# EAGLE design Qduino_Mini (EAGLE 7.4.0)
DESIGNER: Quin from Qtechknow; VERSION: v14
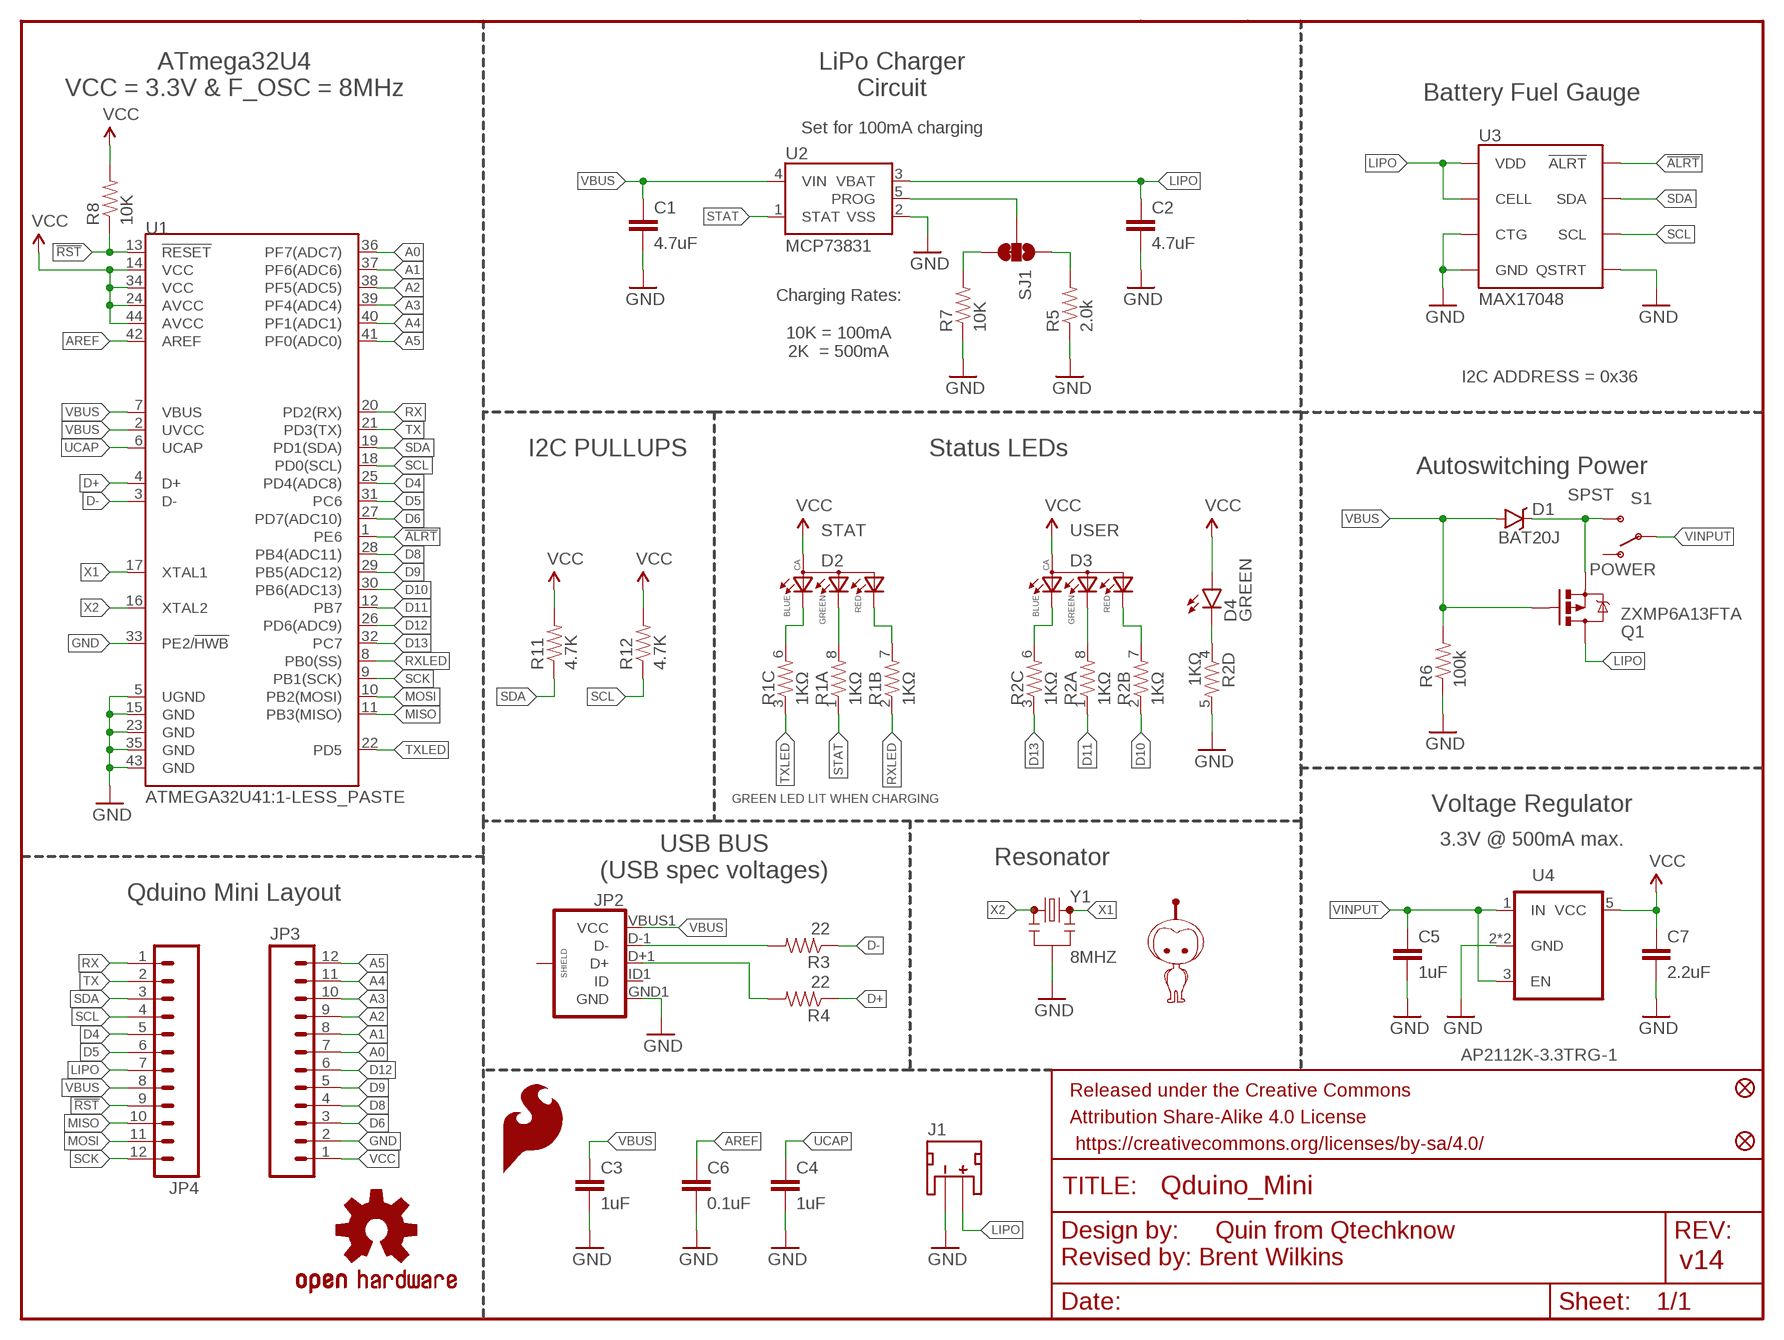
[diagram p0: schematic, sheet 1]

## Parts
C1  4.7uF  CAP0603-CAP  [0603-CAP]
C2  4.7uF  CAP0603-CAP  [0603-CAP]
C3  1uF  CAP0603-CAP  [0603-CAP]
C4  1uF  CAP0603-CAP  [0603-CAP]
C5  1uF  CAP0603-CAP  [0603-CAP]
C6  0.1uF  0.1UF-25V(+80/-20%)(0603)  [0603-CAP]
C7  2.2uF  2.2UF-10V-20%(0603)  [0603-CAP]
D1  BAT20J  DIODE-SCHOTTKY-BAT20J  [SOD-323]
D2  0.13_RGB_LEDPLCC  [P-LCC-4-3]
D3  0.13_RGB_LEDPLCC  [P-LCC-4-3]
D4  GREEN  LED-GREEN0603  [LED-0603]
FID1  FIDUCIALUFIDUCIAL  [MICRO-FIDUCIAL]
FID2  FIDUCIALUFIDUCIAL  [MICRO-FIDUCIAL]
FRAME2  FRAME-LETTER  [CREATIVE_COMMONS]
J1  LiPo  JST_2MM_MALE  [JST-2-SMD]
JP2  USB_MICROB_PLUGCONN-11752  [USB-B-MICRO-SMD_V03]
JP3  M12PTH  [1X12]
JP4  M12PTH  [1X12]
LOGO1  OSHW-LOGOS  [OSHW-LOGO-S]
LOGO2  SFE_LOGO_FLAME.1_INCH  [SFE_LOGO_FLAME_.1]
Q1  ZXMP6A13FTA  MOSFET-PCHANNEL  [SOT23-3]
R1  1KΩ  RESISTOR-ARRAY0603-ARV  [0603-ARV]
R2  1KΩ  RESISTOR-ARRAY0603-ARV  [0603-ARV]
R3  22  RESISTOR0603  [0603-RES]
R4  22  RESISTOR0603  [0603-RES]
R5  2.0k  2.0KOHM1/10W5%(0603)  [0603-RES]
R6  100k  100KOHM-1/10W-1%(0603)  [0603-RES]
R7  10K  10KOHM-1/10W-1%(0603)0603  [0603-RES]
R8  10K  10KOHM-1/10W-1%(0603)0603  [0603-RES]
R11  4.7K  RESISTOR0603-RES  [0603-RES]
R12  4.7K  RESISTOR0603-RES  [0603-RES]
S1  POWER  SWITCH-SPDT-SMD-A  [SWITCH-SPST-SMD-A]
SJ1  JUMPER-PAD-3-2OF3_NC_BY_TRACE_SMALL  [PAD-JUMPER-3-2OF3_NC_BY_TRACE_YES_SILK_FULL_BOX]
U1  ATMEGA32U41:1-LESS_PASTE  [QFN-44-NOPAD_1:1-LESS_PASTE]
U2  MCP73831  [SOT23-5]
U3  MAX17048  MAX17048DFN8  [DFN-8]
U4  AP2112K-3.3TRG-1  LDO-TPS78233  [SOT23-5]
U5  MIGHTYQ-L-SILK  [LOGO-LARGE-SILK]
Y1  8MHZ  RESONATOR8MHZ  [RESONATOR-SMD]

## Nets
!ALRT: U1.1(PE6) U3.P$5(!ALRT)
!RST: JP4.9 R8.1 U1.13(!RESET)
A0: JP3.7 U1.36(PF7(ADC7))
A1: JP3.8 U1.37(PF6(ADC6))
A2: JP3.9 U1.38(PF5(ADC5))
A3: JP3.10 U1.39(PF4(ADC4))
A4: JP3.11 U1.40(PF1(ADC1))
A5: JP3.12 U1.41(PF0(ADC0))
AREF: C6.1 U1.42(AREF)
D4: JP4.5 U1.25(PD4(ADC8))
D5: JP4.6 U1.31(PC6)
D6: JP3.3 U1.27(PD7(ADC10))
D8: JP3.4 U1.28(PB4(ADC11))
D9: JP3.5 U1.29(PB5(ADC12))
D10: R2.2 U1.30(PB6(ADC13))
D11: R2.1 U1.12(PB7)
D12: JP3.6 U1.26(PD6(ADC9))
D13: R2.3 U1.32(PC7)
D+: R4.1 U1.4(D+)
D-: R3.1 U1.3(D-)
GND: C1.2 C2.2 C3.2 C4.2 C5.2 C6.2 C7.2 J1.1(-) JP2.GND1(GND) JP3.2 R2.5 R5.1 R6.1 R7.1 U1.5(UGND) U1.15(GND) U1.23(GND) U1.33(PE2/!HWB) U1.35(GND) U1.43(GND) U2.2(VSS) U3.P$1(CTG) U3.P$4(GND) U3.P$6(QSTRT) U3.P$9(GND) U4.2(GND) U4.4(GND) Y1.2
INMOSFET: D1.C Q1.2(S) S1.3(S)
LIPO: C2.1 J1.2(+) JP4.7 Q1.3(D) U2.3(VBAT) U3.P$2(CELL) U3.P$3(VDD)
MISO: JP4.10 U1.11(PB3(MISO))
MOSI: JP4.11 U1.10(PB2(MOSI))
N$1: D2.3(BLUE) R1.6
N$2: D2.2(GREEN) R1.8
N$3: D3.3(BLUE) R2.6
N$4: D4.C R2.4
N$6: R7.2 SJ1.3
N$7: R5.2 SJ1.1
N$8: D3.2(GREEN) R2.8
N$34: D2.1(RED) R1.7
N$37: D3.1(RED) R2.7
PROG: SJ1.2 U2.5(PROG)
RX: JP4.1 U1.20(PD2(RX))
RXLED: R1.2 U1.8(PB0(SS))
SCK: JP4.12 U1.9(PB1(SCK))
SCL: JP4.4 R12.1 U1.18(PD0(SCL)) U3.P$7(SCL)
SDA: JP4.3 R11.1 U1.19(PD1(SDA)) U3.P$8(SDA)
STAT: R1.1 U2.1(STAT)
TX: JP4.2 U1.21(PD3(TX))
TXLED: R1.3 U1.22(PD5)
UCAP: C4.1 U1.6(UCAP)
UD+: JP2.D+1(D+) R4.2
UD-: JP2.D-1(D-) R3.2
VBUS: C1.1 C3.1 D1.A JP2.VBUS1(VCC) JP4.8 Q1.1(G) R6.2 U1.2(UVCC) U1.7(VBUS) U2.4(VIN)
VCC: C7.1 D2.4(ANODE) D3.4(ANODE) D4.A JP3.1 R8.2 R11.2 R12.2 U1.14(VCC) U1.24(AVCC) U1.34(VCC) U1.44(AVCC) U4.5(VCC)
VINPUT: C5.1 S1.2(P) U4.1(IN) U4.3(EN)
X1: U1.17(XTAL1) Y1.3
X2: U1.16(XTAL2) Y1.1
Unconnected: J1.NC1(PAD1) J1.NC2(PAD2) JP2.ID1(ID) JP2.SHIELD1(SHIELD) JP2.SHIELD2(SHIELD) JP2.SHIELD3(SHIELD) R1.4 R1.5 S1.1(O)

## Notes on the sheet
- ATmega32U4
  VCC = 3.3V & F_OSC = 8MHz
- LiPo Charger
  Circuit
- Battery Fuel Gauge
- Set for 100mA charging
- Charging Rates:
  
  10K = 100mA
  2K  = 500mA
- I2C ADDRESS = 0x36
- I2C PULLUPS | Status LEDs
- Autoswitching Power
- SPST
- STAT | USER
- GREEN LED LIT WHEN CHARGING | Voltage Regulator
- 3.3V @ 500mA max.
- USB BUS
  (USB spec voltages)
- Resonator
- Qduino Mini Layout
- Revised by: Brent Wilkins

## Library data of the parts
C1 C2 = SparkFun-Passives:CAP: Capacitor Standard 0603 ceramic capacitor, and 0.1" leaded capacitor.; PROD_ID: CAP-08280
C3-C5 = SparkFun-Passives:CAP: Capacitor Standard 0603 ceramic capacitor, and 0.1" leaded capacitor.; PROD_ID: CAP-00868
C6 = SparkFun-Capacitors:0.1UF-25V(+80/-20%)(0603): CAP-00810 Ceramic Standard decoupling cap; PROD_ID: CAP-00810
C7 = SparkFun-Capacitors:2.2UF-10V-20%(0603): CAP-07888; PROD_ID: CAP-07888
D1 = SparkFun-DiscreteSemi:DIODE-SCHOTTKY: Schottky diodes in SFE's production catalog BAT20J 1A 23V 0.62Vf RB751 120mA 40V 0.37Vf PMEG4005EJ 0.5A 40V 0.42Vf MBRA140 1A 40V 0.5Vf B340A 3A 40V SMA; PROD_ID: DIO-11623
D2 D3 = SparkFun-LED:0.13_RGB_LED: Everlight Red/Green/Blue LED 67-23/R6GHBHC-B01/2T || 67-23/R6GHBH-B01 Size 3.2*2.8*1.9mm Mounting Type SMD Full-Color LED PLCC4 Emitting Color Red/Green/Blue (620-625/530-535/470-475 nm) Chip Material AlGaInP/InGaN/InGaN Luminous Intensity 57-112/225-450/36-72 mcd Viewing Angle 120 deg Lens Type-Color Water Clear Forward Voltage 2.0/3.5/3.5 V Forward Current 10 mA Maximum Forward Voltage 2.4/3.9/3.9 V Maximum Forward Current 25/25/25 mA Min-Max Operating Temperature -40C to +85C Factory Pack 2000 pcs-Reel RoHS ✓; PROD_ID: DIO-12986
D4 = SparkFun-LED:LED-GREEN: Various green LEDs Green LEDs used in SFE Production 0603- DIO-00821 LARGE- DIO-00862 LILYPAD- DIO-09910; PROD_ID: DIO-00821
FID1 FID2 = SparkFun-Aesthetics:FIDUCIAL: Fiducial Alignment Points Various fiducial points for machine vision alignment.
FRAME2 = SparkFun-Aesthetics:FRAME-LETTER: Schematic Frame Standard 8.5x11 US Letter frame
J1 = SparkFun-Connectors:JST_2MM_MALE: Mates to single-cell LiPo batteries. CONN-11443 Now with smashable polarity marks!; BTM_NEG: -; BTM_POS: +; PROD_ID: CONN-11443; TOP_NEG: -; TOP_POS: +
JP2 = SparkFun-Connectors:USB_MICROB_PLUG: USB Micro-B connectors Some male, some female. Watch your step!; PROD_ID: CONN-11752
JP3 JP4 = SparkFun-Connectors:M12: Header 12 Standard 12-pin 0.1" header. Use with straight break away headers (SKU : PRT-00116), right angle break away headers (PRT-00553), swiss pins (PRT-00743), machine pins (PRT-00117), and female headers (PRT-00115).; PROD_ID: CONN-09693
LOGO1 = SparkFun-Aesthetics:OSHW-LOGO: Open Source Hardware Logo This logo indicates the piece of hardware it is found on incorporates a OSHW license and/or adheres to the definition of open source hardware found here: http://freedomdefined.org/OSHW
LOGO2 = SparkFun-Aesthetics:SFE_LOGO_FLAME: SFE Logo, flame only This is the SparkFun flame logo. The logo on the schematic will always be the same size; the package variant is the height of the flame. Default layer for the logo on the board is tSilk.
Q1 = SparkFun-DiscreteSemi:MOSFET-PCHANNEL: Generic PMOSFET IRLML2244 - TRANS-11153 (SOT-23 -20V -4.3A) (1.Gate 2.Source 3.Drain) FQP27P06 - COM-10349 <http://www.sparkfun.com/products/10349> (TO-220 -60V -27A) (1.Gate 2.Source 3.Drain); PROD_ID: TRANS-08285
R1 R2 = SparkFun-Passives:RESISTOR-ARRAY: Array Chip Resistor Source: RS Component / Phycomp; PROD_ID: RES-12985
R3 R4 = SparkFun-Resistors:RESISTOR: Resistor Basic schematic elements and footprints for 0603, 1206, and PTH resistors.; PROD_ID: RES-08698
R5 = SparkFun-Resistors:2.0KOHM1/10W5%(0603): RES-08296; PROD_ID: RES-08296
R6 = SparkFun-Resistors:100KOHM-1/10W-1%(0603): RES-07828; PROD_ID: RES-07828
R7 R8 = SparkFun-Resistors:10KOHM-1/10W-1%(0603): RES-00824; PROD_ID: RES-00824
R11 R12 = SparkFun-Passives:RESISTOR: Resistor Basic schematic elements and footprints for 0603, 1206, and PTH resistors.; PROD_ID: RES-07857
S1 = SparkFun-Electromechanical:SWITCH-SPDT: SPDT Switch Simple slide switch, Spark Fun Electronics SKU : COM-00102 DPDT SMT slide switch, AYZ0202, SWCH-08179; PROD_ID: SWCH-10651
SJ1 = SparkFun-Passives:JUMPER-PAD-3-2OF3_NC_BY_TRACE
U1 = SparkFun-DigitalIC:ATMEGA32U4: Atmel 44-pin 8-bit Microcontroller with 32KBytes of ISP Flash and USB Controller; PROD_ID: IC-10828
U2 = SparkFun:MCP73831: Microchip's MCP73831 Miniature single cell, fully integrated Li-Ion, Li-polymer charge management controller http://ww1.microchip.com/downloads/en/DeviceDoc/21984a.pdf; PROD_ID: IC-09995
U3 = SparkFun-DigitalIC:MAX17048: Micropower 1-Cell Li+ ModelGauge; PROD_ID: IC-12551
U4 = SparkFun-PowerIC:LDO-TPS78233: Voltage Regulator LDO 500nA Ground Current, 150mA, Ultra-Low Quiescent Current Low-Dropout Linear Regulator.; PROD_ID: VREG-12457
U5 = SparkFun-Aesthetics:MIGHTYQ-L-SILK
Y1 = SparkFun-FreqCtrl:RESONATOR: Resonator Small SMD resonator. Used, eg, on the Arduino Pro/ Pro Mini boards. 8MHz- XTAL-08895 16MHz- XTAL-08900; PROD_ID: XTAL-08895

## Net classes
2 gnd: width 0.254 mm, drill 0.61 mm, clearance 0.254 mm

## Board
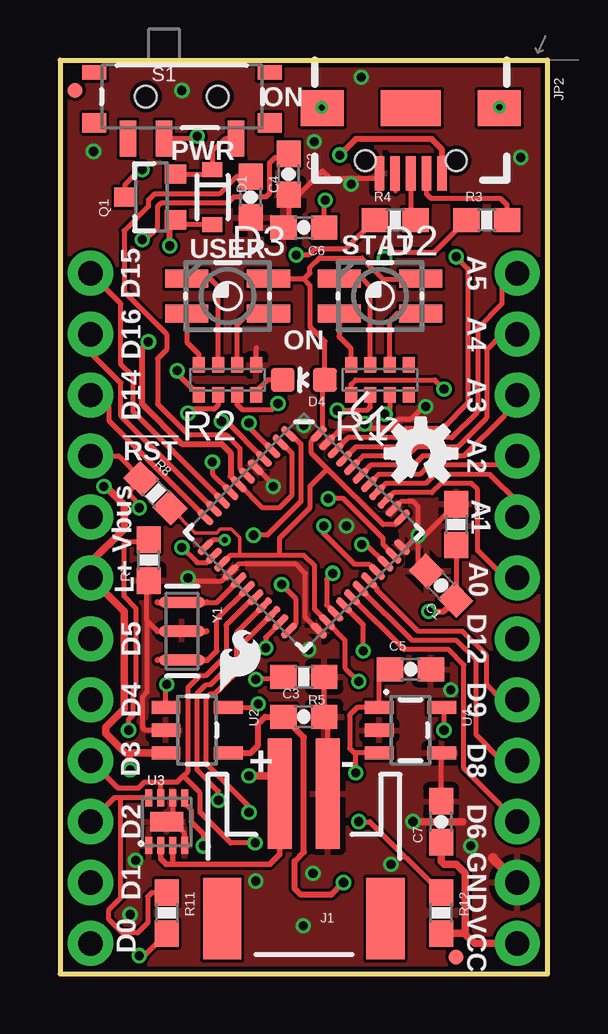
[diagram p1: board, top side]
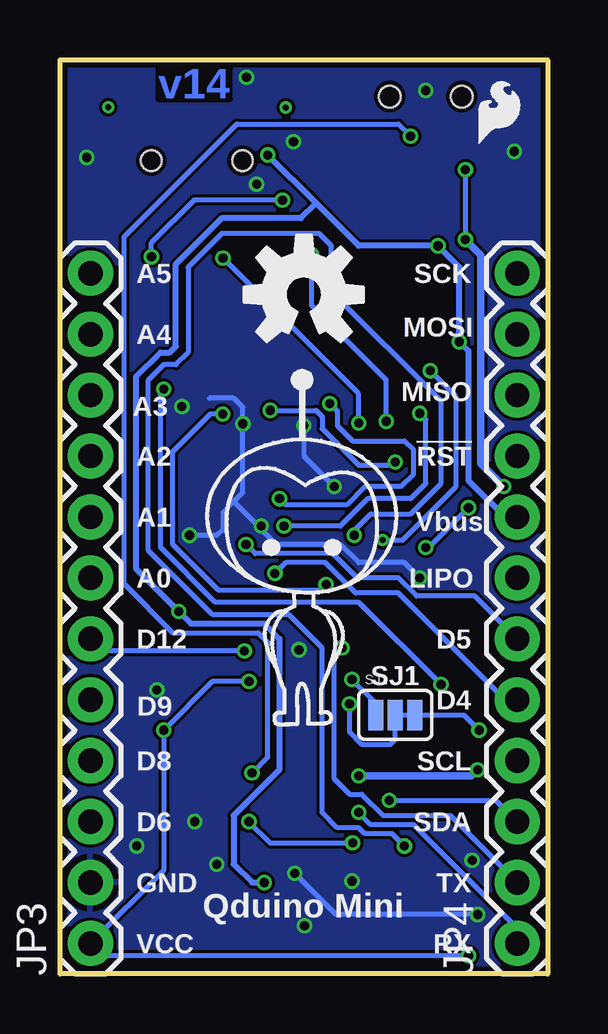
[diagram p2: board, bottom side, seen from below]

Size 20.32 x 38.1 mm. Coordinates in mm from the lower left corner, seen from the top.
Outline: 0,38.1 0,0 20.32,0 20.32,38.1 0,38.1
Copper layers (1*16): Top 0.035mm / dielectric 1.5mm / Bottom 0.035mm
Design rules "Gold_Phoenix_Standard_Spec_2_layer": minimum track width 5mil, minimum drill 6mil, track to track 5mil, track to pad 5mil, pad to pad 5mil, via to via 5mil, smd to smd 5mil, copper to edge 8mil, drill to drill 8mil, minimum pad ring 5mil, minimum via ring 5mil, stop-mask expansion 4mil, vias tented up to drill 20mil, thermal gap 10mil
tRestrict: area 4.3,13.4 to 5.9,13.8; area 4.3,14.7 to 4.4,15.2; area 4.4,16 to 5.9,16

### Footprints (pad centres in the part's own frame; a part is rotated, then mirrored left to right if it is on the bottom)
0603-CAP = smd 1.1 x 1: 1 -0.85,0; 2 0.85,0
SOD-323 = smd 0.63 x 0.83: A 1.15,0; C -1.15,0
P-LCC-4-3 = smd 0.75 x 1.8: 1 0.725,1.7; 2 -0.725,1.7; 3 -0.725,-1.7; 4 0.725,-1.7
LED-0603 = smd 1 x 1: A 0,-0.877; C 0,0.877
MICRO-FIDUCIAL = smd 0.635 x 0.635: 1 0,0
JST-2-SMD = smd 1 x 4.6: 1 -1,-3.7; 2 1,-3.7 | smd 1.6 x 3.4: NC1 -3.4,1.5; NC2 3.4,1.5
USB-B-MICRO-SMD_V03 = smd 1.45 x 0.4: D+1 2.725,0; D-1 2.725,0.65; GND1 2.725,-1.3; ID1 2.725,-0.65; VBUS1 2.725,1.3 | smd 1.5 x 1.8: SHIELD1 0,3.685; SHIELD2 0,-3.685 | smd 1.5 x 2.5: SHIELD3 0,0 | hole 0.85: 2.2,1.9; 2.2,-1.9
1X12 = drill 1.016 pad 1.88: 1 0,0; 2 2.54,0; 3 5.08,0; 4 7.62,0; 5 10.16,0; 6 12.7,0; 7 15.24,0; 8 17.78,0; 9 20.32,0; 10 22.86,0; 11 25.4,0; 12 27.94,0
SOT23-3 = smd 0.8 x 0.9: 1 -0.95,-1; 2 0.95,-1; 3 0,1.1
0603-ARV = smd 0.5 x 0.65: 1 -1.2,-0.625; 2 -0.4,-0.625; 3 0.4,-0.625; 4 1.2,-0.625; 5 1.2,0.625; 6 0.4,0.625; 7 -0.4,0.625; 8 -1.2,0.625
0603-RES = smd 1.1 x 1: 1 -0.85,0; 2 0.85,0
SWITCH-SPST-SMD-A = smd 0.7 x 1.5: 1 -2.25,-1.75; 2 -0.75,-1.75; 3 2.25,-1.75 | smd 1 x 0.6: GND1 -3.65,1; GND3 3.65,1 | smd 1 x 0.8: GND2 -3.65,-1.1; GND4 3.65,-1.1 | hole 0.9: -1.5,0; 1.5,0
PAD-JUMPER-3-2OF3_NC_BY_TRACE_YES_SILK_FULL_BOX = smd 0.635 x 1.27: 1 -0.813,0; 2 0,0; 3 0.813,0
QFN-44-NOPAD_1:1-LESS_PASTE = smd 0.8 x 0.3: 1 -3.337,2.458; 2 -3.337,1.958; 3 -3.337,1.479; 4 -3.337,0.979; 5 -3.337,0.5; 6 -3.337,0; 7 -3.337,-0.5; 8 -3.337,-0.979; 9 -3.337,-1.479; 10 -3.337,-1.958; 11 -3.337,-2.458; 23 3.337,-2.458; 24 3.337,-1.958; 25 3.337,-1.479; 26 3.337,-0.979; 27 3.337,-0.5; 28 3.337,0; 29 3.337,0.5; 30 3.337,0.979; 31 3.337,1.479; 32 3.337,1.958; 33 3.337,2.458 | smd 0.3 x 0.8: 12 -2.458,-3.337; 13 -1.958,-3.337; 14 -1.479,-3.337; 15 -0.979,-3.337; 16 -0.5,-3.337; 17 0,-3.337; 18 0.5,-3.337; 19 0.979,-3.337; 20 1.479,-3.337; 21 1.958,-3.337; 22 2.458,-3.337; 34 2.458,3.337; 35 1.958,3.337; 36 1.479,3.337; 37 0.979,3.337; 38 0.5,3.337; 39 0,3.337; 40 -0.5,3.337; 41 -0.979,3.337; 42 -1.479,3.337; 43 -1.958,3.337; 44 -2.458,3.337
SOT23-5 = smd 0.55 x 1.2: 1 -0.95,-1.3; 2 0,-1.3; 3 0.95,-1.3; 4 0.95,1.3; 5 -0.95,1.3
DFN-8 = smd 0.3 x 0.7: P$1 -0.75,-0.99; P$2 -0.25,-0.99; P$3 0.25,-0.99; P$4 0.75,-0.99; P$5 0.75,0.99; P$6 0.25,0.99; P$7 -0.25,0.99; P$8 -0.75,0.99 | smd 1.38 x 0.8: P$9 0,0
RESONATOR-SMD = smd 0.45 x 1.905: 1 -1.2,0; 2 0,0; 3 1.2,0

### Placement (x,y rotation side)
C1  15.88,16.19 135 top
C2  9.53,33.34 270 top
C3  10.16,10.72 0 top
C4  7.94,32.38 270 top
C5  14.61,12.7 0 top
C6  10.16,31.11 180 top
C7  15.88,6.35 90 top
D1  6.35,32.38 270 top
D2  13.34,28.26 90 top
D3  6.99,28.26 90 top
D4  10.16,24.77 90 top
FID1  0.64,36.83 0 top
FID2  16.51,0.71 0 top
FRAME2  -20.9,-8.66 0 top  (outside the outline)
J1  10.16,3.81 180 top
JP2  14.62,36.1 270 top
JP3  19.05,1.27 90 bottom
JP4  1.27,1.27 90 bottom
LOGO1  15.04,21.69 0 top
LOGO2  3.17,34.29 0 bottom
LOGO3  SFE_LOGO_FLAME.1_INCH  [SFE_LOGO_FLAME_.1@1]  6.35,11.43 0 top
Q1  3.81,32.38 90 top
R1  13.34,24.77 0 top
R2  6.99,24.77 0 top
R3  17.78,31.43 0 top
R4  13.97,31.43 0 top
R5  10.16,12.38 180 top
R6  16.51,18.73 270 top
R7  3.7,17.25 90 top
R8  3.99,20.04 315 top
R11  4.45,2.54 270 top
R12  15.88,2.54 270 top
S1  5.08,36.58 0 top
SJ1  6.35,10.79 0 bottom
U1  10.16,18.41 315 top
U2  5.71,10.16 270 top
U3  4.45,6.35 0 top
U4  14.61,10.16 270 top
U5  10.16,15.88 0 bottom
U$4  [OSHW-LOGO-M@1]  10.16,28.32 0 bottom
Y1  5.08,14.29 270 top

### Tracks (layer width: path | path; a pad name or v marks a point on that pad's centre or on a via)
!ALRT  (via drill 0.38)
  Top 0.203: U1.1 9.62,22.51 10.03,22.1 10.03,19.68 8.64,18.29 v8.06,18.29 | v5.97,5.33 5.97,5.84 5.46,6.35 5.46,6.83 5.2,7.1 U3.P$5
  Bottom 0.203: v8.06,18.29 8.06,18.48 7.37,19.18 5.71,19.18 4.45,20.45 4.45,23.88 9.02,28.45 9.02,30.35 9.53,30.86 13.59,30.86 14.99,29.46 14.99,25.91 15.49,25.4 16,25.4 16.64,24.77 16.64,17.65 13.97,14.99 10.79,14.99 9.4,13.59 9.4,6.73 8.76,6.1 7.87,6.1 7.62,5.84 6.48,5.84 v5.97,5.33
!RST  (via drill 0.38)
  Top 0.203: U1.13 6.12,17.14 5.71,17.14 v5.08,17.78 | JP4.9 2.44,21.59 R8.1 2.92,20.18 2.92,19.94 3.3,19.56 v3.3,19.43
  Bottom 0.203: v3.3,19.43 4.95,17.78 v5.08,17.78
A0
  Top 0.203: JP3.7 18.54,16.51 17.4,17.65 17.4,20.19 17.14,20.45 15.88,20.45 15.49,20.07 13.9,20.07 U1.36
A1
  Top 0.203: JP3.8 19.05,19.68 17.91,20.83 15.62,20.83 15.24,20.45 13.58,20.45 U1.37
A2
  Top 0.203: JP3.9 18.8,21.59 18.41,21.21 15.37,21.21 14.99,20.83 13.28,20.83 U1.38
A3
  Top 0.203: JP3.10 18.54,23.62 18.54,23.3 16.83,21.59 15.11,21.59 14.73,21.21 12.95,21.21 U1.39
A4
  Top 0.203: JP3.11 18.41,26.67 17.78,26.04 17.78,23.18 16.57,21.97 14.86,21.97 14.48,21.59 12.63,21.59 U1.40
A5
  Top 0.203: JP3.12 18.92,29.21 18.41,28.7 18.41,27.94 17.4,26.92 17.4,23.43 16.32,22.35 14.61,22.35 14.22,21.97 12.33,21.97 U1.41
AREF  (via drill 0.38)
  Top 0.203: C6.1 11.01,32.22 v11.05,32.26 | v16.51,29.9 17.02,29.39 17.02,23.81 15.94,22.73 14.35,22.73 13.97,22.35 12.01,22.35 U1.42
  Bottom 0.203: v16.51,29.9 16.51,30.48 14.73,32.26 v11.05,32.26
D4  (via drill 0.38)
  Top 0.203: v11.37,16.7 11.11,16.45 11.11,15.37 U1.25
  Bottom 0.203: JP4.5 1.78,11.43 6.22,15.88 8,15.88 9.27,17.14 10.92,17.14 v11.37,16.7
D5  (via drill 0.38)
  Top 0.203: U1.31 12.76,17.91 v12.57,17.91
  Bottom 0.203: JP4.6 3.05,15.75 5.46,15.75 6.22,16.51 7.94,16.51 8.95,17.53 12.19,17.53 v12.57,17.91
D6
  Top 0.203: JP3.3 16.83,8.57 16.83,12.89 16.19,13.53 14.34,13.53 U1.27
D8
  Top 0.203: JP3.4 18.41,8.89 17.34,9.97 17.34,13.08 16.51,13.91 14.67,13.91 U1.28
D9
  Top 0.203: JP3.5 18.41,11.43 17.78,12.06 17.78,13.27 16.76,14.29 14.92,14.29 13.21,16 13.21,16.07 U1.29
D10  (via drill 0.38)
  Top 0.203: v10.99,18.67 10.99,18.35 12.26,17.08 12.88,17.08 U1.30 | R2.2 6.58,23.7 6.43,23.55 5.51,23.55 v5.33,23.37
  Bottom 0.203: v5.33,23.37 5.08,23.11 5.08,20.45 5.71,19.81 7.49,19.81 8.64,18.67 v10.99,18.67
D11  (via drill 0.25, 0.38)
  Top 0.203: v6.87,18.09 6.35,18.09 U1.12 | R2.1 4.89,25.04 v4.89,25.15
  Bottom 0.203: v6.87,18.09 6.04,18.09 3.81,20.32 3.81,24.07 v4.89,25.15
D12  (via drill 0.38)
  Top 0.203: v12.64,13.46 12.64,14.55 U1.26
  Bottom 0.203: v12.64,13.46 18.54,13.46 JP3.6
D13  (via drill 0.38)
  Top 0.203: U1.32 13.9,17.46 13.46,17.91 13.46,18.16 11.81,19.81 v11.18,19.81 | R2.3 7.38,23.73 7.59,23.52 8.83,23.52 v9.08,23.77
  Bottom 0.203: v11.18,19.81 10.92,19.56 8.38,19.56 7.62,20.32 6.1,20.32 5.59,20.83 5.59,21.84 5.97,22.23 8.13,22.23 8.76,22.86 8.76,23.46 v9.08,23.77
D+  (via drill 0.38)
  Top 0.203: v6.73,23.04 6.92,23.04 U1.4 | R4.1 11.91,30.23 10.62,30.23 10.36,29.97 v9.84,29.97
  Bottom 0.203: v6.73,23.04 6.73,24.77 9.84,27.88 v9.84,29.97
D-  (via drill 0.38)
  Top 0.203: v13.53,29.84 13.78,30.1 15.6,30.1 R3.1 | 8.51,22.16 U1.3 7.87,22.79 v7.87,22.96
  Bottom 0.203: v7.87,22.96 7.87,24.19 v13.53,29.84
GND  (via drill 0.38)
  Top 0.203: 15.55,9.21 U4.4 15.88,9.18 C7.2 15.56,7.51 | U1.15 | R2.5 8.19,26.09 | U1.15 7.1,16.75 | 6.87,16.51 U1.15 | 6.1,14.29 4.06,14.29 3.62,14.73 | 3.62,14.73 3.62,16.22 | v5.33,16.51 5.46,16.38 6.74,16.38 U1.15 | U1.33 14.43,17.79 v14.92,18.29 | C1.2 14.92,17.14 v14.92,18.29 | 14.99,23.5 14.61,23.11 14.1,23.11 13.72,22.73 11.71,22.73 U1.43 | U2.2 3.56,10.16 3.43,10.29 3.43,11.56 3.62,11.75 3.62,14.73 | C6.2 9.53,31.33 C2.2 9.95,32.49 10.93,33.47 11.26,33.15 13.34,33.15 13.31,33.17 JP2.GND1 | v8.89,20.32 8.89,20.39 U1.5 | C4.2 7.94,31.18 | R6.1 15.22,18.29 v14.92,18.29 | v14.92,18.29 14.92,19.49 14.73,19.68 14.2,19.68 U1.35 | U1.15 7.44,17.08 9.84,17.08 10.22,16.7 10.22,14.86 10.77,14.32 U1.23 11.01,14.09 | 4.44,6.35 U3.P$9 | 3.05,2.6 v2.92,2.48 | J1.1 11.16,10.57 C3.2 R5.1 | 16.78,6.3 16.78,6.35 | U3.P$4 5.2,5.85 4.98,6.07 4.72,6.07 4.72,6.08 U3.P$9 | U3.P$6 4.7,6.62 4.45,6.37 U3.P$9
  Top 0.305: 16.78,6.35 v14.71,6.35
  Top 0.406: JP3.2 18.03,4.83
  Bottom 0.203: 13.08,19.68 12.7,20.07 12.7,23.62 13.08,24 14.1,24 | 13.08,19.68 13.53,19.24 13.53,18.54 13.78,18.29 v14.92,18.29 | v10.16,22.86 10.16,21.59 v8.89,20.32 | v5.33,16.51 5.97,17.14 7.87,17.14 8.64,17.91 11.3,17.91 13.08,19.68 | v2.92,2.48 8.83,2.48 v10.54,4.19
  other vias: 15.24,23.65 10.13,2.01 5.08,36.83 19.2,34.04 10.36,13.51 1.4,34.29 17.12,5.33 13.79,4.57 16.28,11.84 12.7,22.94 3.15,4.74 8.15,3.87 11.94,18.67 12.13,32.92 10.59,34.7 12.55,37.38
  pour Bottom: 0,38.1 20.32,38.1 20.32,0 0,0
  pour Top: 0,38.1 20.32,38.1 20.32,0 0,0
INMOSFET
  Top 0.203: Q1.2 6.15,33.34 D1.C 6.35,34.29 6.89,34.83 S1.3
LIPO  (via drill 0.38)
  Top 0.203: 8.89,7.24 J1.2 9.16,8.26 | C2.1 9.37,34.04 8.95,34.04 8.73,33.81 8.73,32.54 8.57,32.38 7.24,32.38 6.99,32.13 4.19,32.13 4.06,32 4.06,31.11 3.56,30.61 v3.43,30.61 | Q1.3 2.71,32.91 3.33,33.53 v3.43,33.53 | 2.9,9.21 2.73,9.21
  Top 0.229: 4.67,4.57 4.42,4.57 4.2,4.8 U3.P$2 | 4.67,4.57 8.74,4.57 9.16,4.99 J1.2 | U3.P$3 4.7,4.59 4.67,4.57
  Top 0.305: 2.73,9.21 1.91,10.03 1.91,10.29 2.67,11.05 2.67,15.11 JP4.7 1.27,17.14 2.67,18.54 2.67,19.56 1.91,20.32 v1.83,20.32 | U2.3 2.9,9.21 2.9,8.53 v2.92,8.51 | v7.87,8.26 9.16,8.26
  Bottom 0.203: v3.43,33.53 v3.43,30.61
  Bottom 0.305: v3.43,30.61 2.79,29.97 2.79,21.29 v1.83,20.32 | v2.92,8.51 3.17,8.26 v7.87,8.26
MISO
  Top 0.203: JP4.10 1.52,24.13 2.03,23.62 2.03,23.07 U1.11
MOSI
  Top 0.203: U1.10 2.54,23.27 2.54,24.64 1.27,25.91 JP4.11
N$1
  Top 0.203: D2.3 14.04,27.53 13.73,27.22 R1.6
N$2
  Top 0.203: D2.2 11.63,26.58 12.13,26.08 R1.8
N$3
  Top 0.203: D3.3 7.85,27.53 7.38,27.07 R2.6
N$4
  Top 0.203: D4.C 8.66,24.77 8.19,24.29 R2.4
N$5
  Top 0.203: 13.97,32.89 13.97,32.64
N$6  (via drill 0.38)
  Top 0.203: v2.86,10.16 2.86,10.6 3.05,10.79 3.05,11.81 3.17,11.94 3.17,15.24 2.67,15.75 2.67,17.91 2.79,18.03 3.51,18.03 3.57,18.1 R7.2
  Bottom 0.203: SJ1.3 3.49,10.79 v2.86,10.16
N$7  (via drill 0.38)
  Top 0.203: v8.15,12.28 8.19,12.32 9.25,12.32 R5.2
  Bottom 0.203: v8.15,12.28 7.16,11.29 SJ1.1
N$8
  Top 0.203: D3.2 5.29,26.34 5.79,25.84 R2.8
N$9  (via drill 0.25)
  other vias: 18.31,36.13
N$10  (via drill 0.25)
  other vias: 10.91,36.12
N$34
  Top 0.203: R1.7 12.94,28.66 12.61,28.98 D2.1
N$37
  Top 0.203: R2.7 6.58,28.66 6.26,28.98 D3.1
PROG  (via drill 0.38)
  Top 0.203: U2.5 8.11,11.11 v8.26,11.25
  Bottom 0.203: v8.26,11.25 8.26,10.08 7.72,9.55 6.58,9.55 6.35,9.78 SJ1.2
RX  (via drill 0.38)
  Top 0.203: 8.79,15.01 U1.20 7.75,13.91 7.75,12.95 6.48,11.68 6.29,11.68 6.1,11.49 6.1,8.76 7.87,6.99 v7.87,6.73
  Bottom 0.203: JP4.1 1.27,1.91 5.59,6.22 7.37,6.22 v7.87,6.73
RXLED  (via drill 0.38)
  Top 0.203: v11.56,23.5 12.8,23.5 12.93,23.62 R1.2 | v6.35,21.34 6.35,20.84 U1.8
  Bottom 0.203: v11.56,23.5 9.65,23.5 9.4,23.24 9.4,22.73 7.87,21.21 6.48,21.21 v6.35,21.34
SCK
  Top 0.203: U1.9 3.05,23.44 3.05,24.89 2.54,25.4 2.54,27.94 JP4.12
SCL  (via drill 0.38)
  Top 0.203: U1.18 8.08,15.7 6.92,14.54 6.92,13.27 6.1,12.45 5.84,12.45 5.33,11.94 5.33,8.45 5.14,8.25 | 4.17,8 3.53,8 3.28,7.75 2.41,7.75 JP4.4 | 4.17,8 4.89,8 5.14,8.25 | v8.13,5.46 7.11,5.46 5.84,6.73 5.84,7.54 5.14,8.25 | v12.45,6.35 12.91,6.35 R12.1 | U3.P$7 4.2,7.97 4.17,8
  Bottom 0.203: v12.45,6.35 11.56,5.46 v8.13,5.46
SDA  (via drill 0.38)
  Top 0.203: 2.25,7.33 JP4.3 | U1.19 7.37,14.24 7.37,13.14 6.29,12.06 6.1,12.06 5.71,11.68 5.71,8.51 6.6,7.62 v6.6,7.24 | R11.1 3.82,3.39 3.65,3.22 3.65,2.13 3.24,1.71 2.6,1.71 2.03,2.29 2.03,2.67 2.54,3.17 2.54,7.33 2.25,7.33 | U3.P$8 2.26,7.34 2.25,7.33
  Bottom 0.203: v6.6,7.24 2.16,7.24 JP4.3
STAT  (via drill 0.38)
  Top 0.203: R1.1 12.13,24.58 12.32,24.77 15.62,24.77 v16,24.38 | U2.1 4.42,12.04 v4.45,12.06
  Bottom 0.203: v4.45,12.06 7.87,15.49 13.84,15.49 16.13,17.78 16.13,24.26 v16,24.38
TX  (via drill 0.38)
  Top 0.203: U1.21 9.19,14.65 8.57,14.03 v8.57,13.59
  Bottom 0.203: JP4.2 4.06,6.6 6.86,6.6 7.75,7.49 8.26,7.49 8.89,8.13 8.89,13.27 v8.57,13.59
TXLED  (via drill 0.38)
  Top 0.203: U1.22 9.84,14.62 9.84,15.62 v9.23,16.23 | R1.3 13.73,23.54 v13.54,23.34
  Bottom 0.203: v9.23,16.23 9.46,16 13.72,16 15.62,17.91 15.62,21.78 14.06,23.34 v13.54,23.34
UCAP
  Top 0.203: C4.1 7.35,33.23 6.63,32.51 3.94,32.51 3.68,32.26 3.68,32 2.67,30.99 2.67,28.45 4.45,26.67 4.45,26.04 4.06,25.65 4.06,23.75 5.33,22.48 6.92,22.48 7.49,21.91 7.49,21.08 U1.6
UD+
  Top 0.203: JP2.D+1 14.62,31.64 R4.2
UD-
  Top 0.203: R3.2 18.63,32.06 18.36,32.32 15.47,32.32 15.27,32.52 JP2.D-1
VBUS  (via drill 0.38)
  Top 0.203: JP2.VBUS1 15.91,33.23 | 6.47,31.11 D1.A 5.01,31.23 Q1.1 4.57,31.2 | U1.2 9.21,22.16 9.65,21.72 9.65,19.94 9.14,19.43 8.44,19.43 U1.7 | R6.2 16.51,15.62 C1.1
  Top 0.254: v15.37,15.11 16,15.11 C1.1 | U1.7 7.11,20.76 7.11,21.72 6.73,22.1 5.08,22.1 3.43,23.75 3.43,26.1 v3.68,26.35 | v4.57,30.35 4.57,31.2 | U2.4 7.94,9.21 8.26,9.53 8.26,10.41 8.56,10.72 C3.1 10.16,9.87 10.16,5.08 9.78,4.7 9.78,3.56 10.03,3.3 11.3,3.3 v11.81,3.81 | v11.66,34.14 12.32,34.8 15.49,34.8 15.91,34.38 JP2.VBUS1
  Bottom 0.203: 15.49,29.59 15.49,28.83
  Bottom 0.254: v11.81,3.81 12.32,3.81 13.08,4.57 13.08,6.6 11.18,8.51 11.18,13.97 11.81,14.61 14.86,14.61 v15.37,15.11 17.14,16.89 17.14,24.89 16.13,25.91 15.75,25.91 15.49,26.16 15.49,29.59 13.59,31.5 10.29,31.5 9.65,32.13 | 9.65,32.13 7.87,30.35 v4.57,30.35 3.68,29.46 v3.68,26.35 3.3,25.97 3.3,20.57 1.78,19.05 JP4.8 | 9.65,32.13 v11.66,34.14
VCC  (via drill 0.38)
  Top 0.152: 7.49,17.46 7.49,18.19 7.14,18.54 6.68,18.54 6.53,18.39 5.64,18.39 R8.2
  Top 0.203: U1.14 7.12,17.46 7.49,17.46 9.14,17.46 | 9.14,17.46 10.16,17.46 10.6,17.02 10.6,15.2 U1.24 11.13,14.65 11.87,13.91 11.87,12.76 v12.45,12.19 | U1.34 14.26,19.02 13.97,18.73 13.46,18.73 11.14,21.05 | 11.14,21.05 10.48,21.72 10.48,22.21 U1.44 10.92,22.65 10.92,24.51 11.04,24.63 D4.A 11.04,26.36 10.41,26.99 10.41,28.7 10.16,28.96 | 11.14,21.05 10.41,20.32 10.41,19.43 9.14,18.16 9.14,17.46 | v16,10.16 16,11.01 U4.5 | R11.2 3.52,0.76 v3.3,0.76 | D3.4 10.13,28.98 10.16,28.96 | 10.16,28.96 10.41,29.21 10.41,29.46 10.79,29.84 12.57,29.84 13.46,28.96 15.01,28.96 D2.4 | 10.16,28.96
  Top 0.305: C7.1 15.88,4.7 16,4.57 16.51,4.57 16.89,4.19 16.89,1.65 | 16.89,1.65 17.27,1.27 JP3.1 | R12.2 16.85,1.69 16.89,1.65
  Bottom 0.203: v12.45,12.19 13.97,12.19 v16,10.16 16,4.32 JP3.1 18.54,0.76 v3.3,0.76
VINPUT  (via drill 0.38)
  Top 0.203: C5.1 13.3,12.25 U4.1 12.38,11.11 12.06,10.79 12.06,9.4 12.13,9.34 12.25,9.21 | U4.3 12.25,9.21 | v5.71,34.92 5.62,34.83 S1.2 | v12.32,8.38 12.32,9.14 12.25,9.21
  Bottom 0.203: v5.71,34.92 6.22,35.43 12.95,35.43 17.65,30.73 17.65,16.26 15.62,14.22 12.06,14.22 11.68,13.84 11.68,9.02 v12.32,8.38
X1
  Top 0.203: 6.1,13.09 6.17,13.09 6.54,13.46 6.54,14.8 U1.17
X2
  Top 0.203: 6.1,15.49 6.53,15.49 U1.16

### Text on the board
tPlace: ON | PWR | USER | STAT | D15 | A5 | D16 | A4 | ON | D14 | A3 | A2 | !RST | Vbus | A1 | L+ | A0 | D5 | D12 | D4 | D9 | D3 | D8 | D2 | D6 | D1 | GND | D0 | VCC
bPlace: SCK | A5 | MOSI | A4 | MISO | A3 | !RST | A2 | Vbus | A1 | LIPO | A0 | D5 | D12 | SJ1 | D4 | D9 | SCL | D8 | SDA | D6 | TX | GND | Qduino Mini | RX | VCC
tDocu: Revised by: Brent Wilkins